# Altium schematic sheet XMOS_power.SchDoc
size Tabloid; DocumentNumber: 3; SheetNumber: 3; SheetTotal: 11; SheetName: XMOS power supply; Size: 11x17; Sheet_Name: XMOS power supply
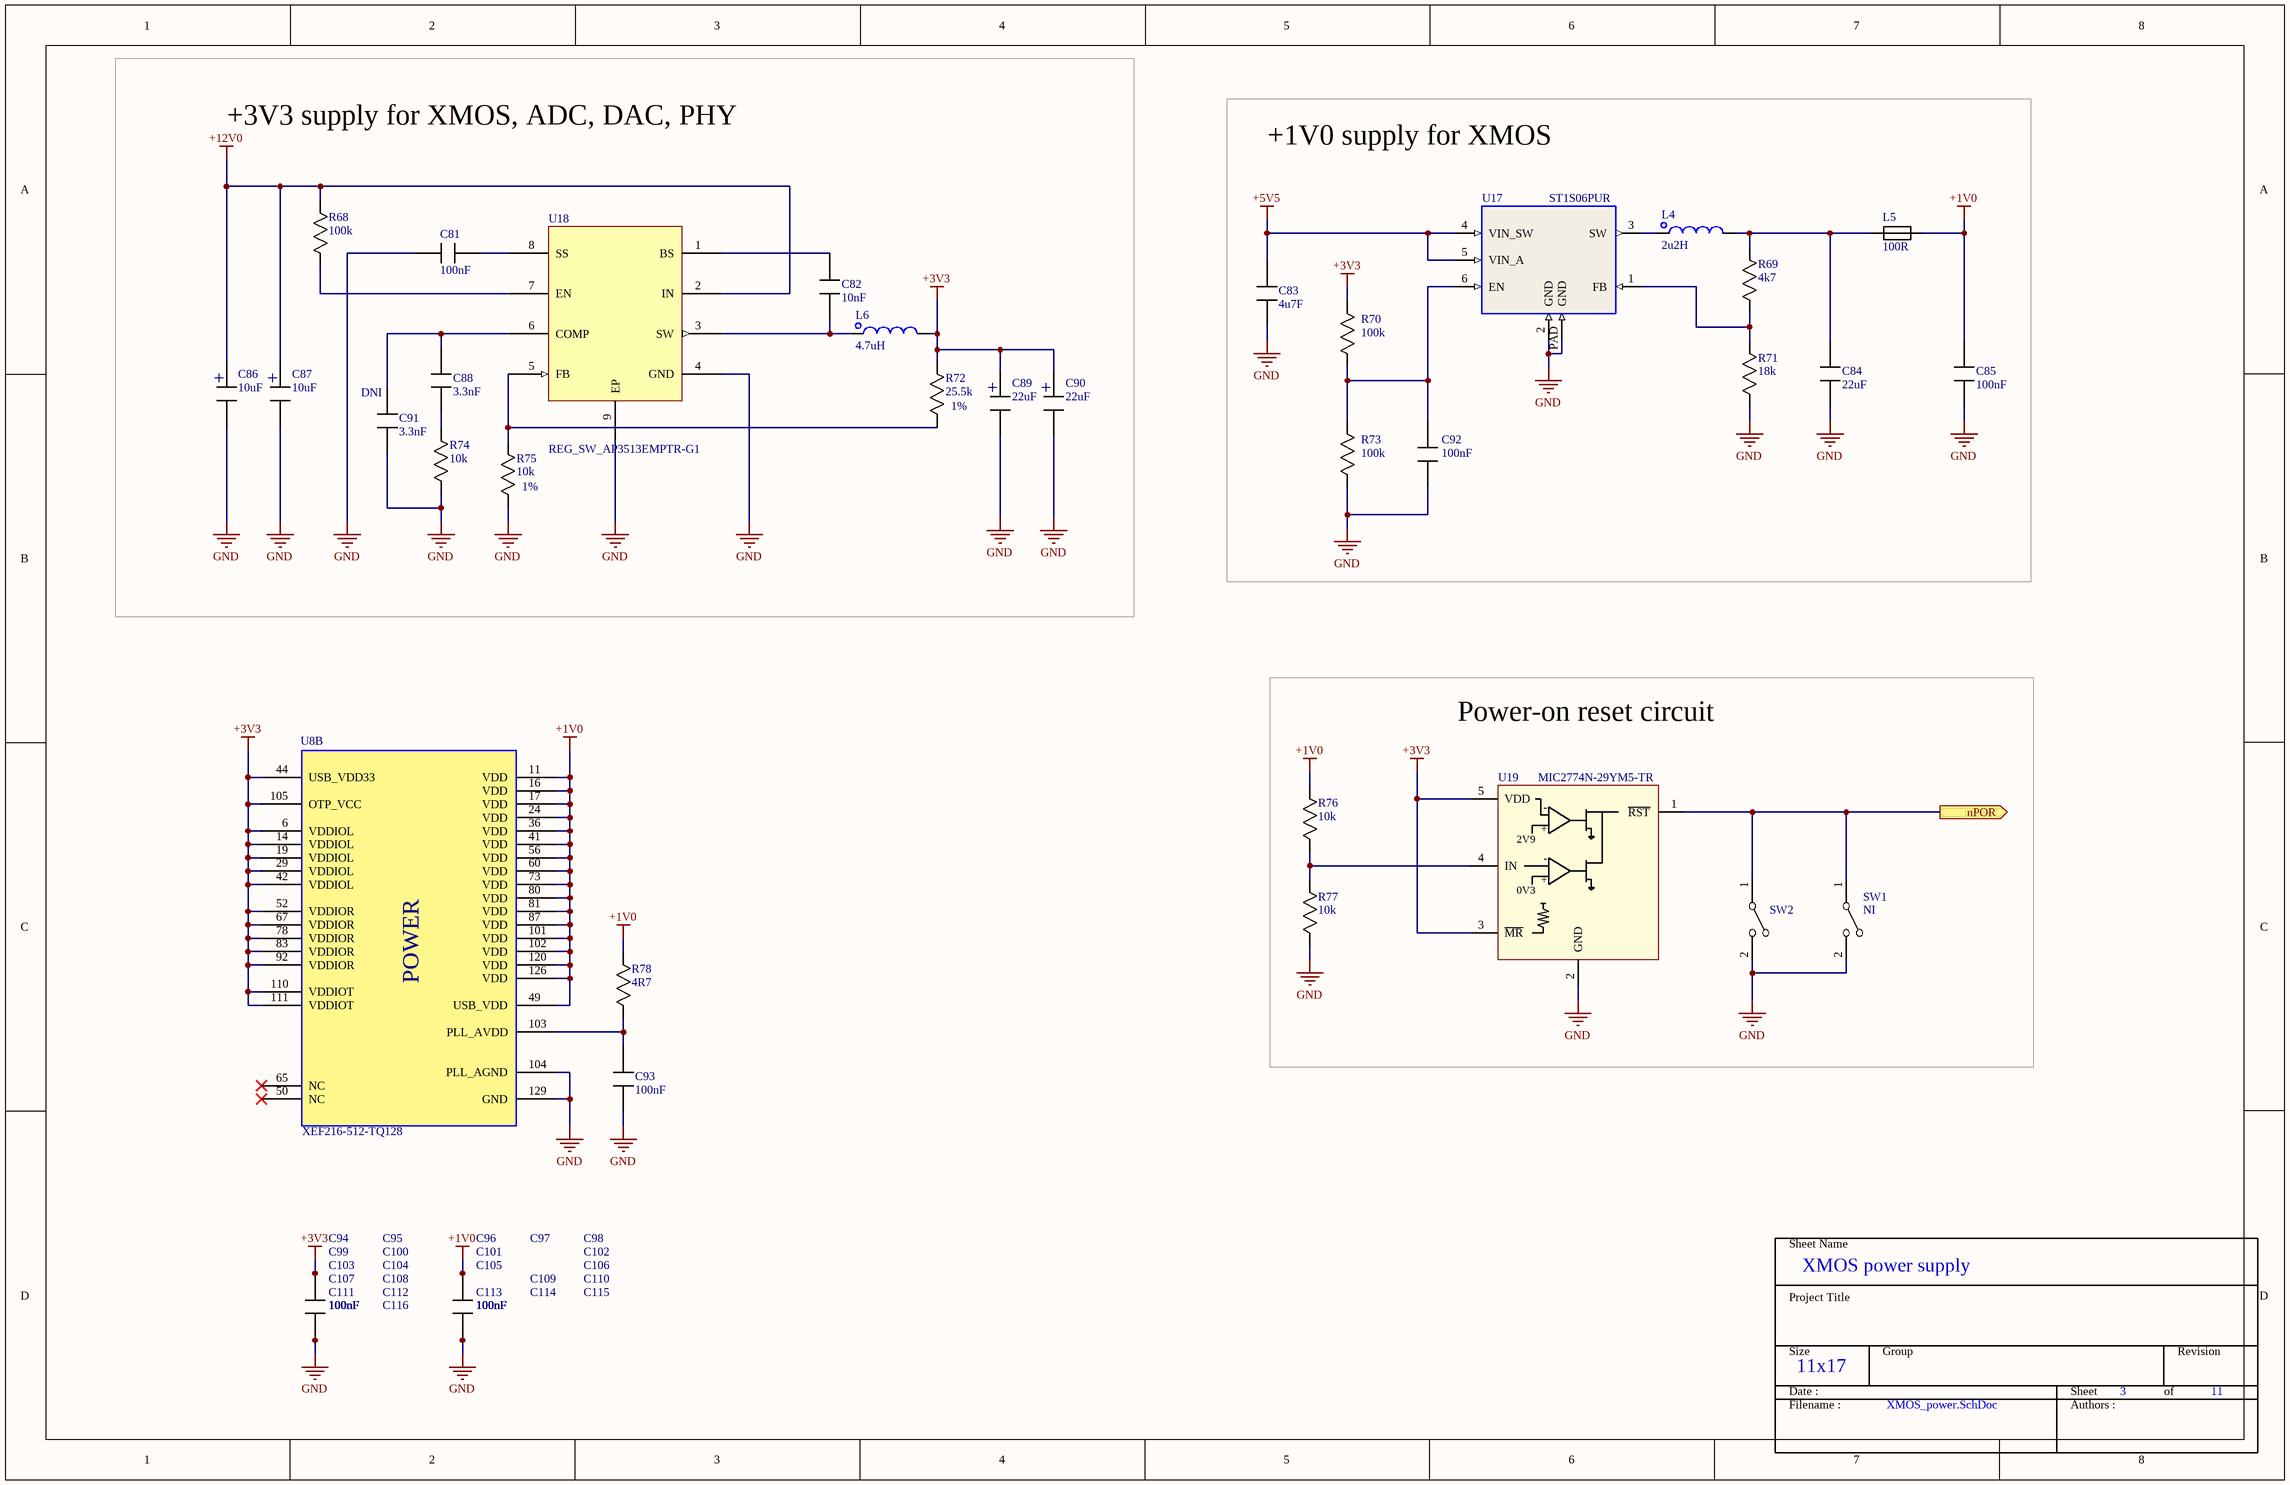
[diagram p0: XMOS_power.SchDoc]

## Parts
C81  value 100nF  [0603]  (hidden comment: Capacitor)
C82  value 10nF  [0603]  (hidden comment: Capacitor)
C83  value 4u7F  [0805]  (hidden comment: Capacitor)
C84  value 22uF  [1206]  (hidden comment: Capacitor)
C85  value 100nF  [0603]  (hidden comment: Capacitor)
C86  value 10uF  [CAP_RAD_SMD_DIA157]  (hidden comment: Capacitor_Polarized)
C87  value 10uF  [CAP_RAD_SMD_DIA157]  (hidden comment: Capacitor_Polarized)
C88  value 3.3nF  [0603]  (hidden comment: Capacitor)
C89  value 22uF  [CAP_RAD_SMD_DIA157]  (hidden comment: Capacitor_Polarized)
C90  value 22uF  [CAP_RAD_SMD_DIA157]  (hidden comment: Capacitor_Polarized)
C91  value 3.3nF  note: DNI  [0603]  (hidden comment: Capacitor)
C92  value 100nF  [0603]  (hidden comment: Capacitor)
C93  value 100nF  [0603]  (hidden comment: Capacitor)
C94  value 100nF  [0603]  (hidden comment: Capacitor)
C95  value 100nF  [0603]  (hidden comment: Capacitor)
C96  value 100nF  [0603]  (hidden comment: Capacitor)
C97  value 100nF  [0603]  (hidden comment: Capacitor)
C98  value 100nF  [0603]  (hidden comment: Capacitor)
C99  value 100nF  [0603]  (hidden comment: Capacitor)
C100  value 100nF  [0603]  (hidden comment: Capacitor)
C101  value 100nF  [0603]  (hidden comment: Capacitor)
C102  value 100nF  [0603]  (hidden comment: Capacitor)
C103  value 100nF  [0603]  (hidden comment: Capacitor)
C104  value 100nF  [0603]  (hidden comment: Capacitor)
C105  value 100nF  [0603]  (hidden comment: Capacitor)
C106  value 100nF  [0603]  (hidden comment: Capacitor)
C107  value 100nF  [0603]  (hidden comment: Capacitor)
C108  value 100nF  [0603]  (hidden comment: Capacitor)
C109  value 100nF  [0603]  (hidden comment: Capacitor)
C110  value 100nF  [0603]  (hidden comment: Capacitor)
C111  value 100nF  [0603]  (hidden comment: Capacitor)
C112  value 100nF  [0603]  (hidden comment: Capacitor)
C113  value 100nF  [0603]  (hidden comment: Capacitor)
C114  value 100nF  [0603]  (hidden comment: Capacitor)
C115  value 100nF  [0603]  (hidden comment: Capacitor)
C116  value 100nF  [0603]  (hidden comment: Capacitor)
L4  value 2u2H  [IND_252012CDMC/DS]  (hidden comment: Inductor)
L5  value 100R  [0805]  (hidden comment: Ferrite)
L6  value 4.7uH  [SRN5040-4R7M]  (hidden comment: Inductor)
R68  value 100k  [0603]  (hidden comment: Resistor)
R69  value 4k7  [0603]  (hidden comment: Resistor)
R70  value 100k  [0603]  (hidden comment: Resistor)
R71  value 18k  [0603]  (hidden comment: Resistor)
R72  value 25.5k  Tolerance: 1%  [0603]  (hidden comment: Resistor)
R73  value 100k  [0603]  (hidden comment: Resistor)
R74  value 10k  [0603]  (hidden comment: Resistor)
R75  value 10k  Tolerance: 1%  [0603]  (hidden comment: Resistor)
R76  value 10k  [0603]  (hidden comment: Resistor)
R77  value 10k  [0603]  (hidden comment: Resistor)
R78  value 4R7  [0603]  (hidden comment: Resistor)
SW1  Button  [BUTTON_WS-TASV]  (value not drawn)
SW2  Button  [BUTTON_WS-TASV]  (value not drawn)
U8  Mfg_PN: XEF216-512-TQ128  [TQFP128_XMOS]  (part B of 5)
U17  ST1S06PUR  [DFN6_ST1S06]
U18  REG_SW_AP3513EMPTR-G1  [AP3513EMPTR-G1]
U19  MIC2774N-29YM5-TR  [SOT23_5]

## Blocks framed on the sheet
+3V3 supply for XMOS, ADC, DAC, PHY: C81 C82 C86-C91 L6 R68 R72 R74 R75 U18
+1V0 supply for XMOS: C83-C85 C92 L4 L5 R69-R71 R73 U17
Power-on reset circuit: R76 R77 SW1 SW2 U19

## Ports
nPOR (out)

## Nets
+1V0: C85.1 C96.1 C97.1 C98.1 C101.1 C102.1 C105.1 C106.1 C109.1 C110.1 C113.1 C114.1 C115.1 L5.2 R76.1 R78.1 U8.11(VDD) U8.16(VDD) U8.17(VDD) U8.24(VDD) U8.36(VDD) U8.41(VDD) U8.49(USB_VDD) U8.56(VDD) U8.60(VDD) U8.73(VDD) U8.80(VDD) U8.81(VDD) U8.87(VDD) U8.101(VDD) U8.102(VDD) U8.120(VDD) U8.126(VDD)
+3V3: C89.+ C90.+ C94.1 C95.1 C99.1 C100.1 C103.1 C104.1 C107.1 C108.1 C111.1 C112.1 C116.1 L6.2 R70.1 R72.1 U8.6(VDDIOL) U8.14(VDDIOL) U8.19(VDDIOL) U8.29(VDDIOL) U8.42(VDDIOL) U8.44(USB_VDD33) U8.52(VDDIOR) U8.67(VDDIOR) U8.78(VDDIOR) U8.83(VDDIOR) U8.92(VDDIOR) U8.105(OTP_VCC) U8.110(VDDIOT) U8.111(VDDIOT) U19.3(~{MR}) U19.5(VDD)
+5V5: C83.1 U17.4(VIN_SW) U17.5(VIN_A)
+12V0: C86.+ C87.+ R68.2 U18.2(IN)
GND: C81.1 C83.2 C84.2 C85.2 C86.- C87.- C89.- C90.- C91.2 C92.2 C93.2 C94.2 C95.2 C96.2 C97.2 C98.2 C99.2 C100.2 C101.2 C102.2 C103.2 C104.2 C105.2 C106.2 C107.2 C108.2 C109.2 C110.2 C111.2 C112.2 C113.2 C114.2 C115.2 C116.2 R71.2 R73.2 R74.2 R75.2 R77.2 SW1.2 SW2.2 U8.104(PLL_AGND) U8.129(GND) U17.2(GND) U17.PAD(GND) U18.4(GND) U18.9(EP) U19.2(GND)
nPOR: SW1.1 SW2.1 U19.1(~{RST}) ; port nPOR
NetC81_2: C81.2 U18.8(SS)
NetC82_1: C82.1 U18.1(BS)
NetC82_2: C82.2 L6.1 U18.3(SW)
NetC84_1: C84.1 L4.2 L5.1 R69.1
NetC88_1: C88.1 C91.1 U18.6(COMP)
NetC88_2: C88.2 R74.1
NetC92_1: C92.1 R70.2 R73.1 U17.6(EN)
NetC93_1: C93.1 R78.2 U8.103(PLL_AVDD)
NetL4_1: L4.1 U17.3(SW)
NetR68_1: R68.1 U18.7(EN)
NetR69_2: R69.2 R71.1 U17.1(FB)
NetR72_2: R72.2 R75.1 U18.5(FB)
NetR76_2: R76.2 R77.1 U19.4(IN)

Not connected (* = marked no-connect by the designer): SW1 3 4; SW2 3 4; U8 50(NC)* 65(NC)*

## Notes on the sheet
- Sheet Name
- Project Title
- Size
- Group
- Revision
- Date :
- Filename :
- Sheet
- Authors :
- of
- (in symbol MIC2774N-29YM5-TR) -; +; 2V9; 0V3
- (in symbol XMOS_XEF216-512-TQ128, part B) POWER

## Library data of the parts
C81 C85 C92-C116 = Capacitor: Mfg: Samsung; Mfg_PN: CL10F104ZO8NNNC; HelpURL: *; Supplier1: Digikey; Supplier1_PN: 1276-1258-1-ND; Tolerance: *; Type: *; Rating: *
  C81: NI: NI
  C85 C92-C116: NI: *
C82 = Capacitor: Mfg: Samsung; Mfg_PN: CL10B102KB8NNNC; HelpURL: https://www.digikey.ca/product-detail/en/samsung-electro-mechanics/CL10B102KB8NNNC/1276-1018-1-ND/3889104; NI: NI; Supplier1: Digikey; Supplier1_PN: 1276-1018-1-ND; Tolerance: *; Type: *; Rating: *
C83 = Capacitor: Mfg: Samsung; Mfg_PN: CL21A475KAQNNNG; HelpURL: *; NI: *; Supplier1: Digikey; Supplier1_PN: 1276-6462-1-ND; Tolerance: *; Type: *; Rating: *
C84 = Capacitor: Mfg: Samsung; Mfg_PN: CL31F226ZPHNNNE; HelpURL: *; NI: *; Supplier1: Digikey; Supplier1_PN: 1276-3296-1-ND; Tolerance: *; Type: *; Rating: *
C86 C87 C89 C90 = Capacitor_Polarized: Capacitor; Mfg: Nichicon; Mfg_PN: UWX1C100MCL1GB; HelpURL: *; NI: *; Supplier1: Digikey; Supplier1_PN: 493-2100-1-ND; Tolerance: *; Type: *; Rating: *
C88 C91 = Capacitor: Mfg: Samsung; Mfg_PN: CL10B332JB8NNNC; HelpURL: *; NI: NI; Supplier1: Digikey; Supplier1_PN: 1276-2030-1-ND; Tolerance: *; Type: *; Rating: *
L4 = Inductor: Mfg: Murata; Mfg_PN: DFE252012F-2R2M=P2; HelpURL: *; NI: *; Rating: *; Tolerance: *; Supplier1: Digikey; Supplier1_PN: 490-13055-1-ND
L5 = Ferrite: Mfg: Bourns; Mfg_PN: MH2029-101Y; Rating: 1A; HelpURL: *; NI: *; Supplier1: Digikey; Supplier1_PN: MH2029-101YCT-ND; Tolerance: *; Type: *
L6 = Inductor: Mfg: Bourns Inc.; HelpURL: *; Mfg_PN: SRN5040-4R7M; NI: *; Rating: *; Tolerance: *; Supplier1: Digikey; Supplier1_PN: SRN5040-4R7MCT-ND
R68 = Resistor: Mfg: Stackpole Electronics Inc; Mfg_PN: RMCF0603FT100K; HelpURL: https://www.digikey.ca/product-detail/en/stackpole-electronics-inc/RMCF0603FT100K/RMCF0603FT100KCT-ND/1943118; NI: *; Supplier1: Digikey; Supplier1_PN: RMCF0603FT100KCT-ND; Type: *; Rating: *; Tolerance: *
R69 = Resistor: Mfg: Yageo; Mfg_PN: RC0603JR-074K7L; HelpURL: *; NI: *; Supplier1: Digikey; Supplier1_PN: 311-4.7KGRCT-ND; Type: *; Rating: *; Tolerance: *
R70 R73 = Resistor: Mfg: Yageo; Mfg_PN: 311-10GRCT-ND; HelpURL: *; NI: *; Supplier1: Digikey; Supplier1_PN: 311-100KGRCT-ND; Type: *; Rating: *; Tolerance: *
R71 = Resistor: Mfg: Yageo; Mfg_PN: RC0603JR-0718KL; HelpURL: *; NI: *; Supplier1: Digikey; Supplier1_PN: 311-18KGRCT-ND; Type: *; Rating: *; Tolerance: *
R72 = Resistor: Mfg: Stackpole Electronics Inc; Mfg_PN: RMCF0603FT25K5; HelpURL: *; NI: *; Supplier1: Digikey; Supplier1_PN: RMCF0603FT25K5CT-ND; Type: *; Rating: *
R74 R76 R77 = Resistor: Mfg: Yageo; Mfg_PN: RC0603JR-0710KL; HelpURL: *; NI: *; Supplier1: Digikey; Supplier1_PN: 311-10KGRCT-ND; Type: *; Rating: *; Tolerance: *
R75 = Resistor: Mfg: Stackpole Electronics Inc; Mfg_PN: RNCP0603FTD10K0; HelpURL: *; NI: *; Supplier1: Digikey; Supplier1_PN: RNCP0603FTD10K0CT-ND; Type: *; Rating: *
R78 = Resistor: Mfg: Yageo; Mfg_PN: RC0603JR-074R7L; HelpURL: *; NI: *; Supplier1: Digikey; Supplier1_PN: 311-4.7GRCT-ND; Type: *; Rating: *; Tolerance: *
SW1 SW2 = Button: Mfg: Wurth; Mfg_PN: 430152050826; HelpURL: *; Rating: *; Tolerance: *; Value: *; Supplier1: Digikey; Supplier1_PN: 732-6993-1-ND
  SW1: NI: NI
  SW2: NI: *
U8 = XMOS_XEF216-512-TQ128: 32-bit multicore microcontroller. 2 Tiles. 16 Logical Cores. 512KB SRAM. 1000MIPS. TQFP128.; Mfg: XMOS; Supplier1: Digikey; Supplier1_PN: 880-1100-ND
U17 = ST1S06PUR: DC-DC Buck Converter, 1.5A, 1.5MHz, DFN6; Mfg: ST Microelectronics; Mfg_PN: ST1S06PUR; Supplier1: Digikey; Supplier1_PN: 497-5802-1-ND
U18 = REG_SW_AP3513EMPTR-G1: Mfg: Diodes Incorporated; CreatedBy: Emile Laplante; HelpURL: https://www.digikey.ca/product-detail/en/diodes-incorporated/AP3513EMPTR-G1/AP3513EMPTR-G1DICT-ND/4505181; Mfg Part Number: AP3513EMPTR-G1; NI: *; Power: *; Supplier: Digikey; Supplier Part Numer: AP3513EMPTR-G1DICT-ND; Temperature: *; Value: *; VerifiedBy: *; Voltage: *
U19 = MIC2774N-29YM5-TR: Voltage supervisor and power-on timer, dual; Mfg: Micrel; HelpURL: *; Mfg_PN: MIC2774N-29YM5-TR; NI: *; Rating: *; Supplier1: Digikey; Supplier1_PN: 576-1101-1-ND; Tolerance: *; Type: *; Value: *